# EAGLE design New Bench Power Supply 4 - eagle 5.1.0 (EAGLE 5.10)
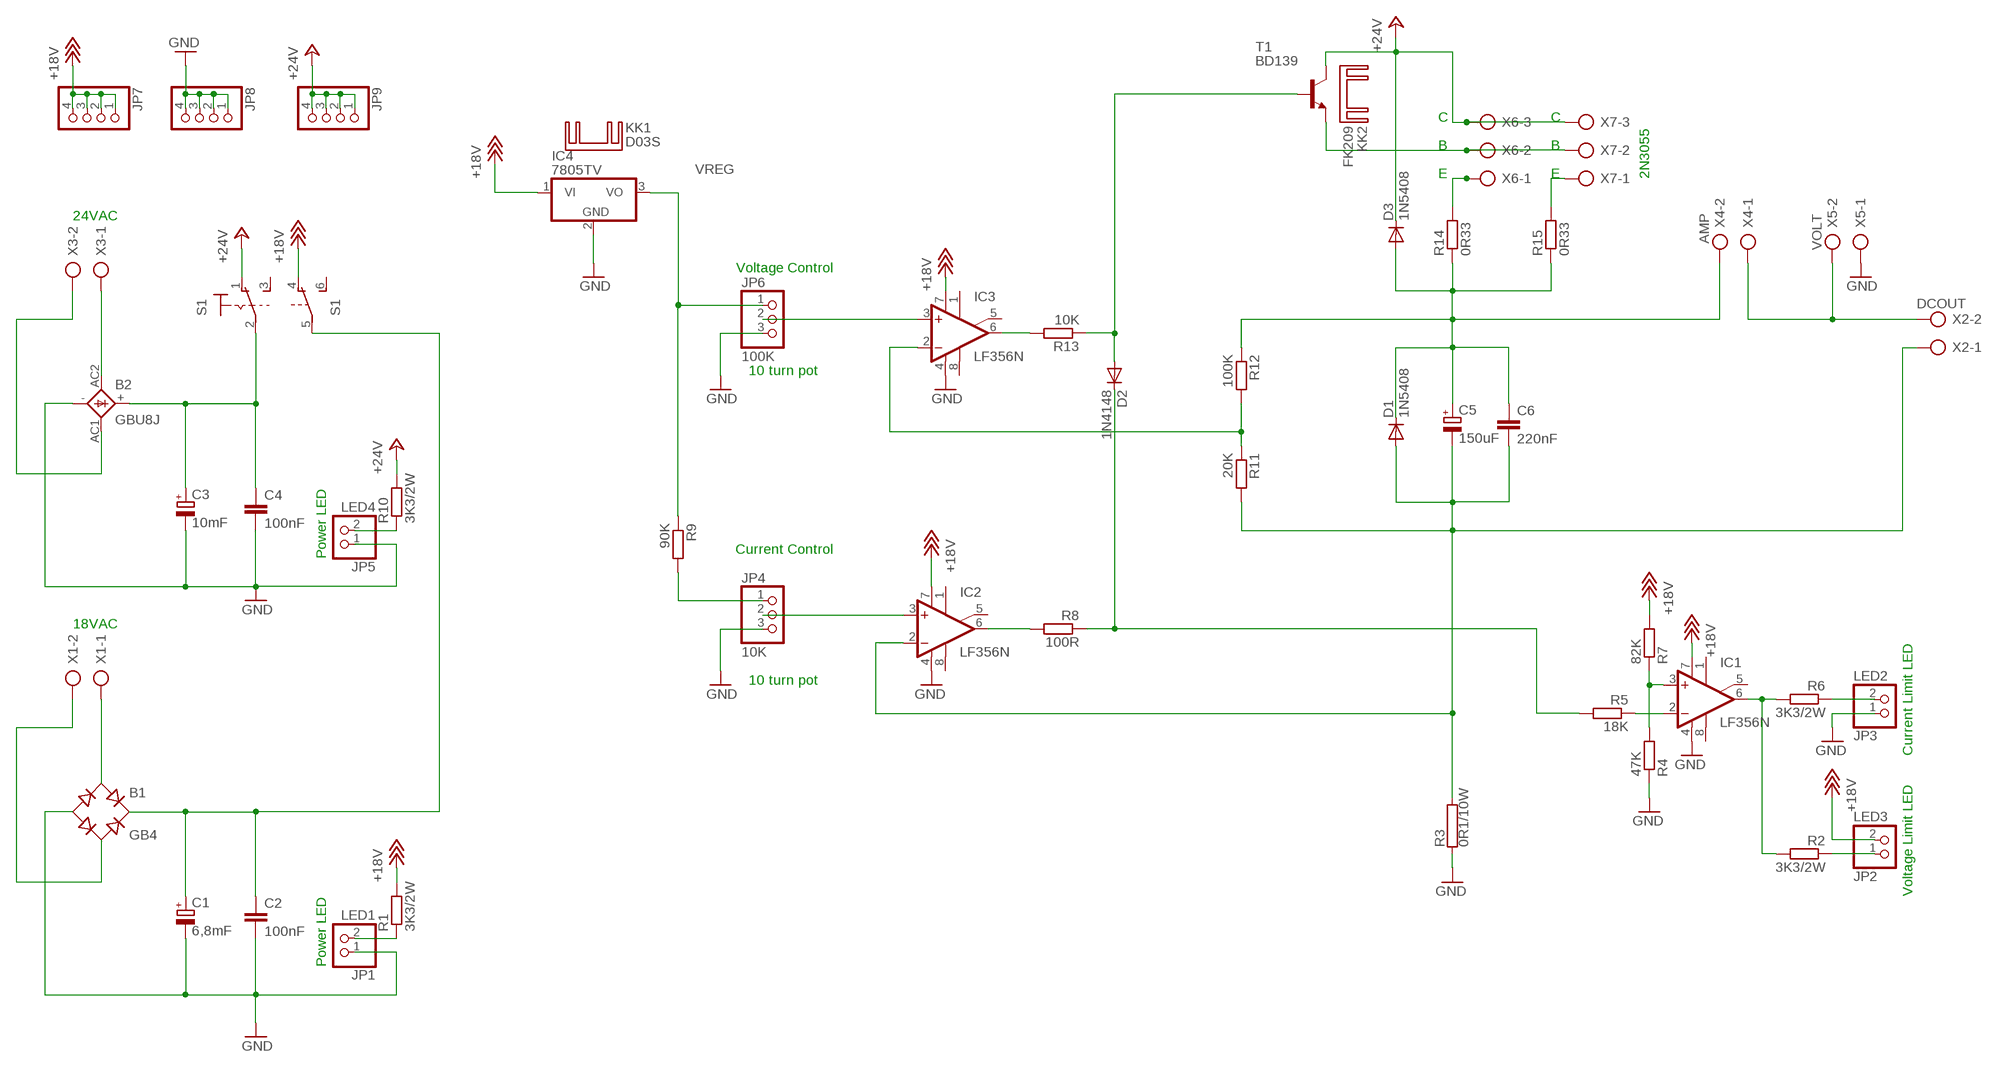
[diagram p0: schematic, sheet 1]

## Parts
B1  GB4  RB1A  [RB1A]
B2  GBU8J  GBU4  [GBU4S]
C1  6,8mF  CPOL-EUE10-30  [EB30D]
C2  100nF  C-EU075-032X103  [C075-032X103]
C3  10mF  CPOL-EUE10-30  [EB30D]
C4  100nF  C-EU075-032X103  [C075-032X103]
C5  150uF  CPOL-EUE7.5-18  [E7,5-18]
C6  220nF  C-EU102-043X133  [C102-043X133]
D1  1N5408  DIODE-DO201-15  [DO201-15]
D2  1N4148  DIODE-DO41-10  [DO41-10]
D3  1N5408  DIODE-DO201-15  [DO201-15]
IC1  LF356N  [DIL08]
IC2  LF356N  [DIL08]
IC3  LF356N  [DIL08]
IC4  7805TV  [TO220V]
JP1  LED1  PINHD-1X2  [1X02]
JP2  LED3  PINHD-1X2  [1X02]
JP3  LED2  PINHD-1X2  [1X02]
JP4  10K  PINHD-1X3  [1X03]
JP5  LED4  PINHD-1X2  [1X02]
JP6  100K  PINHD-1X3  [1X03]
JP7  PINHD-1X4  [1X04]
JP8  PINHD-1X4  [1X04]
JP9  PINHD-1X4  [1X04]
KK1  D03S  [D03S]
KK2  FK209  [FK209]
R1  3K3/2W  R-EU_0309/12  [0309/12]
R2  3K3/2W  R-EU_0309/12  [0309/12]
R3  0R1/10W  RRWM8X26  [RWM8X26]
R4  47K  R-EU_0207/10  [0207/10]
R5  18K  R-EU_0207/10  [0207/10]
R6  3K3/2W  R-EU_0309/12  [0309/12]
R7  82K  R-EU_0207/10  [0207/10]
R8  100R  R-EU_0207/10  [0207/10]
R9  90K  R-EU_0207/10  [0207/10]
R10  3K3/2W  R-EU_0309/12  [0309/12]
R11  20K  R-EU_0207/10  [0207/10]
R12  100K  R-EU_0207/10  [0207/10]
R13  10K  R-EU_0207/10  [0207/10]
R14  0R33  R-EU_0309/12  [0309/12]
R15  0R33  R-EU_0309/12  [0309/12]
S1  320-938  [320-938]
T1  BD139  -NPN-TO126V  [TO126V]
X1  AK300/2  [AK300/2]
X2  DCOUT  AK300/2  [AK300/2]
X3  AK300/2  [AK300/2]
X4  AMP  AK300/2  [AK300/2]
X5  VOLT  AK300/2  [AK300/2]
X6  AK300/3  [AK300/3]
X7  AK300/3  [AK300/3]

## Nets
+18V: IC1.7(V+) IC2.7(V+) IC3.7(V+) IC4.1(VI) JP2.2 JP7.1 JP7.2 JP7.3 JP7.4 R1.2 R7.2 S1.4(B:O)
+24V: D3.C JP9.1 JP9.2 JP9.3 JP9.4 R10.2 S1.1(1:O) T1.2(C) X6.3 X7.3
GND: B1.- B2.- C1.- C2.2 C3.- C4.2 IC1.4(V-) IC2.4(V-) IC3.4(V-) IC4.2(GND) JP1.1 JP3.1 JP4.3 JP5.1 JP6.3 JP8.1 JP8.2 JP8.3 JP8.4 R3.1 R4.1 X5.1
N$1: JP3.2 R6.1
N$2: IC1.6(OUT) R2.2 R6.2
N$3: IC1.2(-IN) R5.1
N$4: IC1.3(+IN) R4.2 R7.1
N$5: D2.C R5.2 R8.1
N$6: IC2.3(+IN) JP4.2
N$7: JP4.1 R9.2
N$8: IC2.6(OUT) R8.2
N$9: X2.2 X4.1 X5.2
N$10: C5.- C6.2 D1.A IC2.2(-IN) R3.2 R11.2 X2.1
N$12: JP2.1 R2.1
N$13: C5.+ C6.1 D1.C D3.A R12.1 R14.1 R15.1 X4.2
N$14: JP1.2 R1.1
N$15: B1.AC1 X1.1
N$16: IC3.3(+IN) JP6.2
N$18: IC3.6(OUT) R13.2
N$19: D2.A R13.1 T1.3(B)
N$20: R14.2 X6.1
N$21: T1.1(E) X6.2 X7.2
N$22: B2.AC2(AC1) X3.1
N$23: IC3.2(-IN) R11.1 R12.2
N$24: B2.AC1(AC2) X3.2
N$25: B1.AC2 X1.2
N$26: R15.2 X7.1
N$27: JP5.2 R10.1
N$33: B2.+ C3.+ C4.1 S1.2(1:P)
N$34: B1.+ C1.+ C2.1 S1.5(B:P)
VREG: IC4.3(VO) JP6.1 R9.1
Unconnected: IC1.1(ON1) IC1.5(ON2) IC1.8(OPT) IC2.1(ON1) IC2.5(ON2) IC2.8(OPT) IC3.1(ON1) IC3.5(ON2) IC3.8(OPT) S1.3(1:S) S1.6(B:S)

## Notes on the sheet
- C | C
- B | B
- E | E | 2N3055
- 24VAC
- Voltage Control
- 10 turn pot
- Current Control
- Power LED
- 18VAC
- 10 turn pot
- Current Limit LED
- Voltage Limit LED
- Power LED

## Library data of the parts
B1 = rectifier:RB1A: RECTIFIER 1 A
B2 = rectifier:GBU4: GENERAL INSTRUMENT RECTIFIER
C1 C3 C5 = resistor:CPOL-EU: POLARIZED CAPACITOR, European symbol
C2 C4 C6 = resistor:C-EU: CAPACITOR, European symbol
D1-D3 = diode:DIODE-: DIODE
IC1-IC3 = linear:LF356: OP AMP
IC4 = linear:78*: Positive VOLTAGE REGULATOR Source: http://cache.national.com/ds/LM/LM78L05.pdf http://www.fairchildsemi.com/ds/LM/LM7805.pdf
JP1-JP3 JP5 = pinhead:PINHD-1X2: PIN HEADER
JP4 JP6 = pinhead:PINHD-1X3: PIN HEADER
JP7-JP9 = pinhead:PINHD-1X4: PIN HEADER
KK1 = heatsink:D03S: HEATSINK distributor Schukat
KK2 = heatsink:FK209: HEATSINK manufacturer Fischer/distributor Buerklin
R1 R2 R4-R15 = resistor:R-EU_: RESISTOR, European symbol
R3 = resistor-power:R: Power Resitor
S1 = switch:320-938: TOGGLE SWITCH distributor RS Components
T1 = transistor:*-NPN-: NPN Transistror BF959 corrected 2008.03.06
X1-X5 = con-ptr500:AK300/2: CONNECTOR
X6 X7 = con-ptr500:AK300/3: CONNECTOR

## Net classes
0 default: width 0.508 mm, drill 0.762 mm, clearance 0.508 mm

## Board
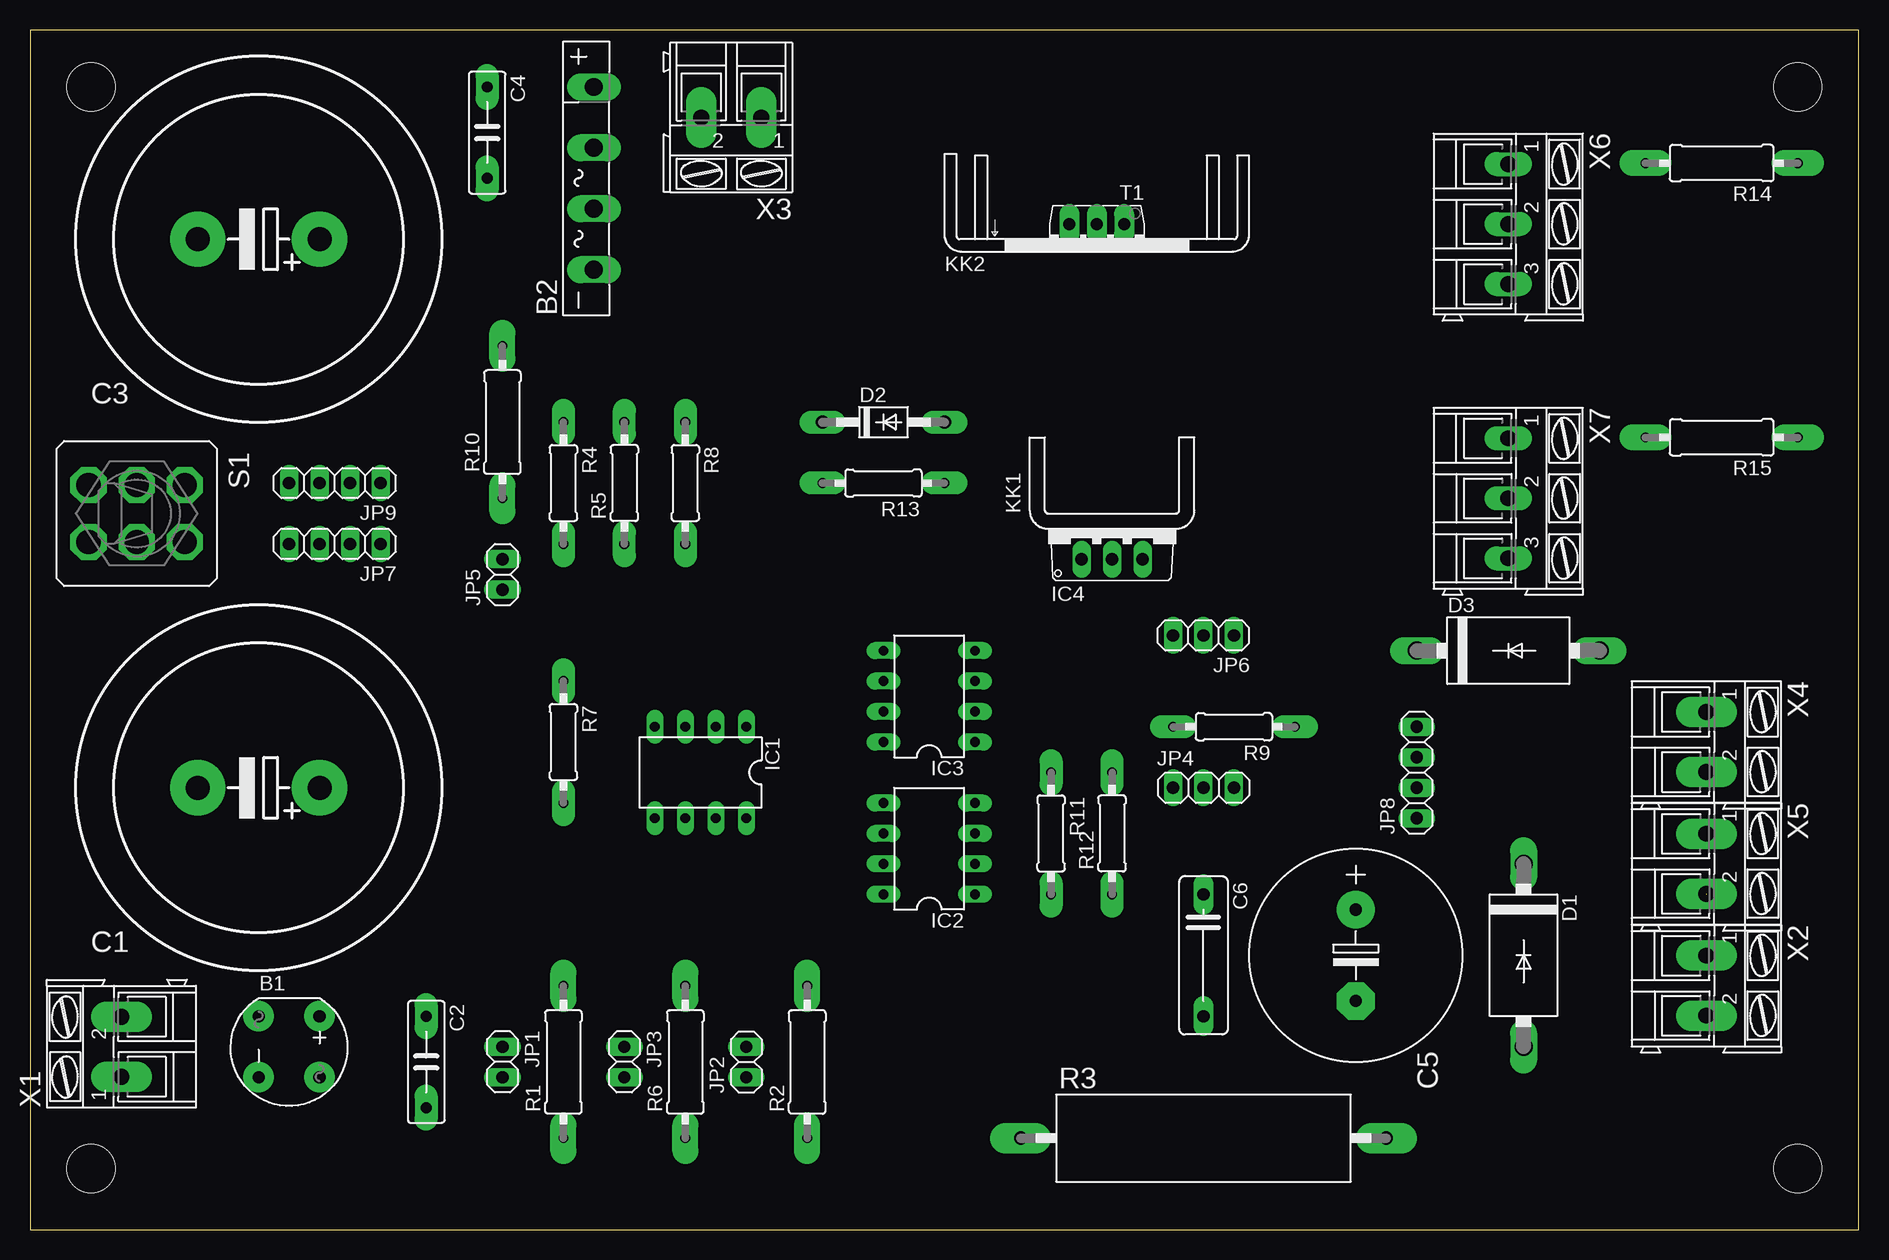
[diagram p1: board, top side]
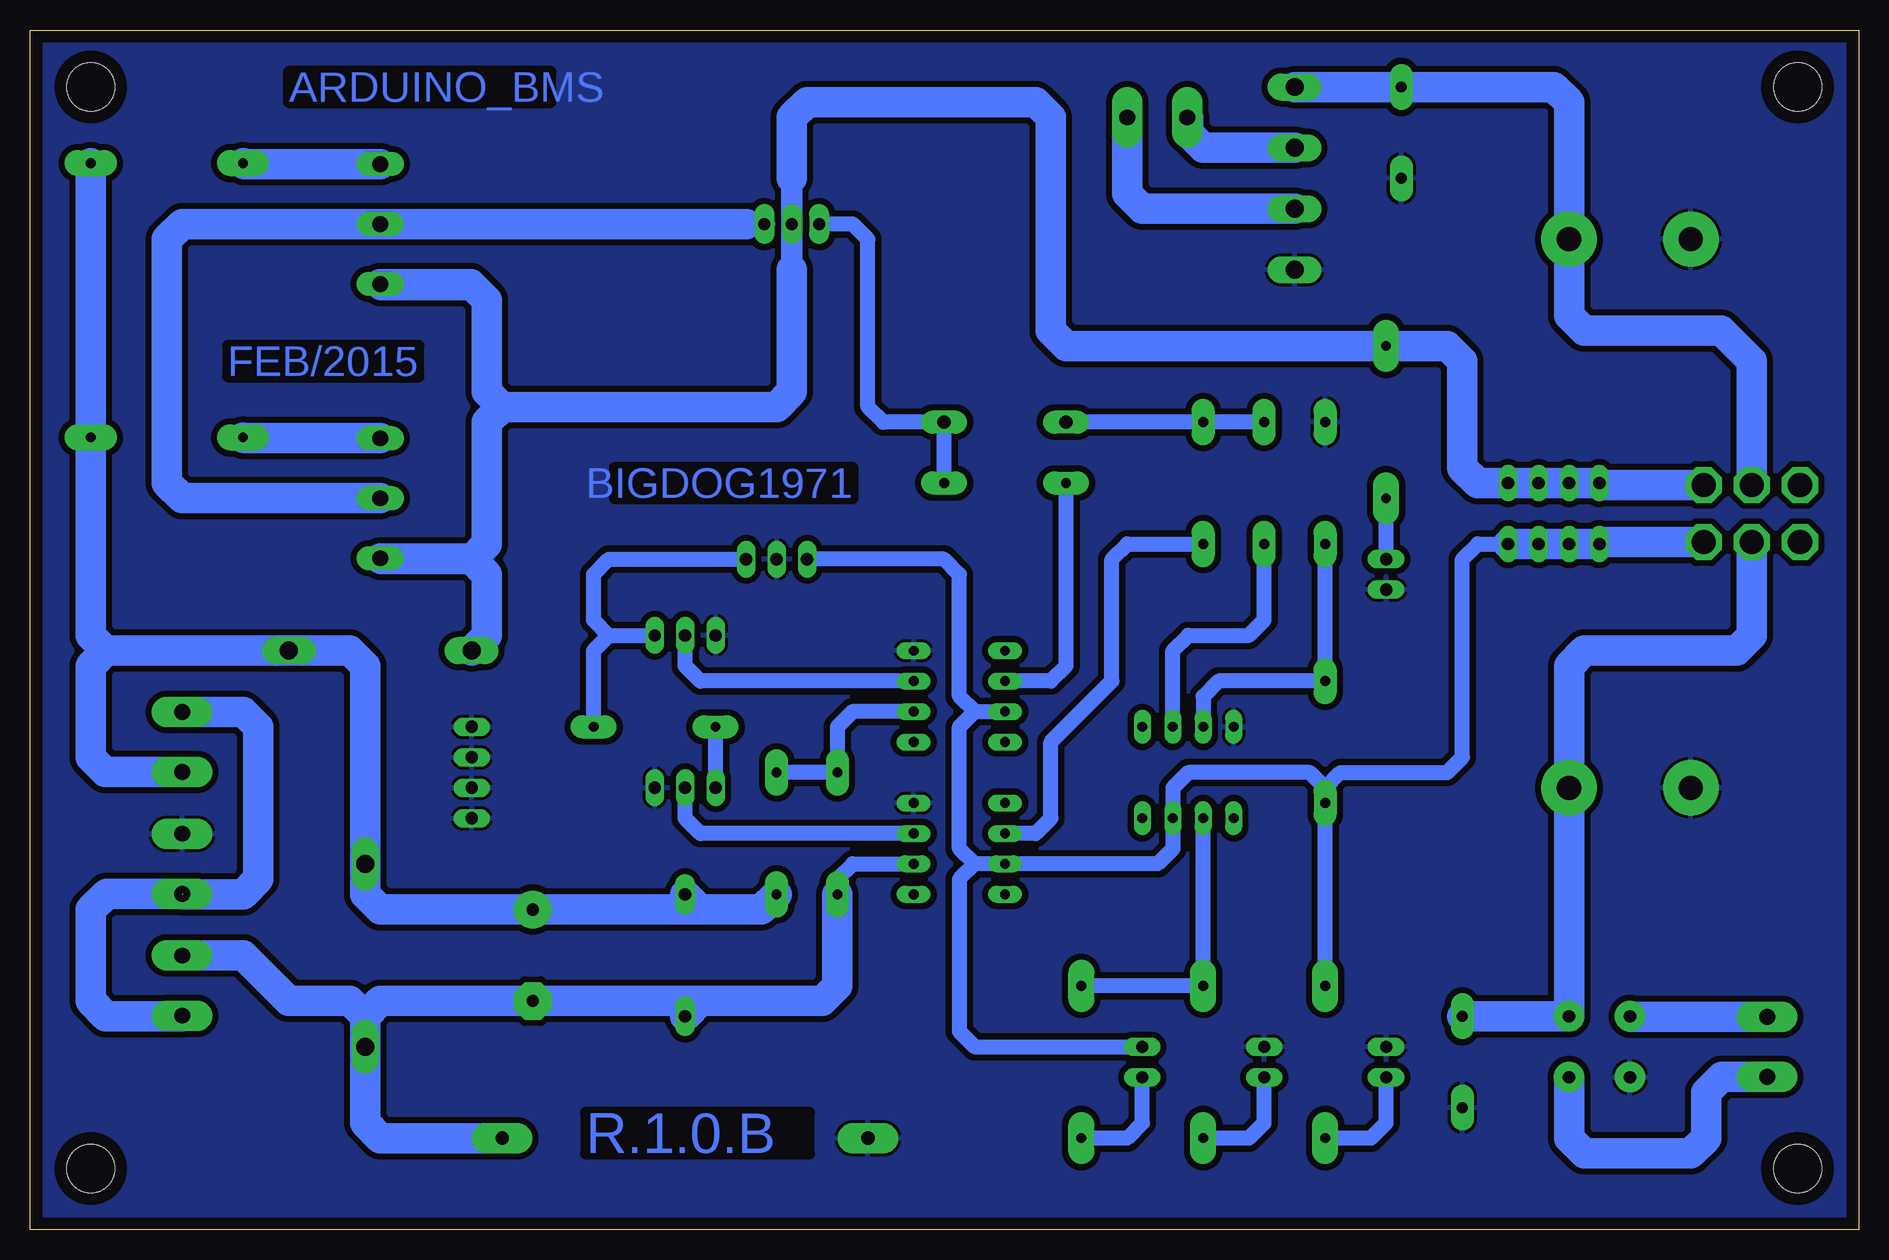
[diagram p2: board, bottom side, seen from below]

Size 152.38 x 100 mm. Coordinates in mm from the lower left corner, seen from the top.
Outline: 0,0 152.38,0 152.38,100 0,100 0,0
Copper layers (1*16): Top 0.035mm / dielectric 1.5mm / Bottom 0.035mm
Design rules "default": minimum track width 10mil, minimum drill 24mil, track to track 8mil, track to pad 8mil, pad to pad 8mil, via to via 8mil, smd to smd 8mil, copper to edge 40mil, drill to drill 8mil, minimum pad ring 10mil, minimum via ring 8mil, stop-mask expansion 4mil, vias tented up to drill 0mil, thermal gap 10mil
Holes 4 mm at 5.08,95.25 147.32,95.25 147.32,5.08 5.08,5.08

### Footprints (pad centres in the part's own frame; a part is rotated, then mirrored left to right if it is on the bottom)
RB1A = drill 1.016 pad 2.54 round: + -2.54,2.54; - 2.54,-2.54; AC1 2.54,2.54; AC2 -2.54,-2.54
GBU4S = drill 1.499 long: + 7.62,0; - -7.62,0; AC1 2.54,0; AC2 -2.54,0
EB30D = drill 2.007 pad 4.597 round: + -5.08,0; - 5.08,0
C075-032X103 = drill 0.914 pad 1.93 long: 1 -3.81,0; 2 3.81,0
E7,5-18 = drill 1.016 pad 3.15 round: + -3.81,0 | drill 1.016 pad 3.15 octagon: - 3.81,0
C102-043X133 = drill 1.016 pad 1.676 long: 1 -5.08,0; 2 5.08,0
DO201-15 = drill 1.499 long: A 7.62,0; C -7.62,0
DO41-10 = drill 1.118 pad 1.93 long: A 5.08,0; C -5.08,0
DIL08 = drill 0.813 pad 1.422 long: 1 -3.81,-3.81; 2 -1.27,-3.81; 3 1.27,-3.81; 4 3.81,-3.81; 5 3.81,3.81; 6 1.27,3.81; 7 -1.27,3.81; 8 -3.81,3.81
TO220V = drill 1.016 long: 1 -2.54,-2.54; 2 0,-2.54; 3 2.54,-2.54
1X02 = drill 1.016 long: 1 -1.27,0; 2 1.27,0
1X03 = drill 1.016 long: 1 -2.54,0; 2 0,0; 3 2.54,0
1X04 = drill 1.016 long: 1 -3.81,0; 2 -1.27,0; 3 1.27,0; 4 3.81,0
0309/12 = drill 0.813 pad 2.184 long: 1 -6.35,0; 2 6.35,0
RWM8X26 = drill 1.1 pad 2.54 long: 1 -15.24,0; 2 15.24,0
0207/10 = drill 0.813 pad 1.93 long: 1 -5.08,0; 2 5.08,0
320-938 = drill 2.007 octagon: 1 -2.388,4.013; 2 -2.388,0; 3 -2.388,-4.013; 4 2.388,4.013; 5 2.388,0; 6 2.388,-4.013
TO126V = drill 1.016 pad 1.676 long: 1 -2.286,-1.27; 2 0,-1.27; 3 2.286,-1.27
AK300/2 = drill 1.321 pad 2.54 long: 1 -2.515,0; 2 2.489,0
AK300/3 = drill 1.321 long: 1 -5.004,0; 2 0,0; 3 5.004,0

### Placement (x,y rotation side)
B1  21.59,15.24 270 top
B2  46.99,87.63 90 top
C1  19.05,36.83 180 top
C2  33.02,13.97 270 top
C3  19.05,82.55 180 top
C4  38.1,91.44 270 top
C5  110.49,22.86 270 top
C6  97.79,22.86 270 top
D1  124.46,22.86 270 top
D2  71.12,67.31 0 top
D3  123.19,48.26 0 top
IC1  55.88,38.1 180 top
IC2  74.93,31.75 90 top
IC3  74.93,44.45 90 top
IC4  90.17,58.42 0 top
JP1  39.37,13.97 270 top
JP2  59.69,13.97 90 top
JP3  49.53,13.97 270 top
JP4  97.79,36.83 0 top
JP5  39.37,54.61 90 top
JP6  97.79,49.53 180 top
JP7  25.4,57.15 180 top
JP8  115.57,38.1 90 top
JP9  25.4,62.23 180 top
KK1  90.17,59.69 0 top
KK2  88.9,82.55 0 top
R1  44.45,13.97 90 top
R2  64.77,13.97 90 top
R3  97.79,7.62 0 top
R4  44.45,62.23 270 top
R5  49.53,62.23 90 top
R6  54.61,13.97 90 top
R7  44.45,40.64 270 top
R8  54.61,62.23 270 top
R9  100.33,41.91 180 top
R10  39.37,67.31 90 top
R11  85.09,33.02 270 top
R12  90.17,33.02 90 top
R13  71.12,62.23 180 top
R14  140.97,88.9 180 top
R15  140.97,66.04 180 top
S1  8.89,59.69 270 top
T1  88.9,82.55 180 top
X1  7.62,15.24 90 top
X2  139.7,20.32 270 top
X3  58.42,92.71 180 top
X4  139.7,40.64 270 top
X5  139.7,30.48 270 top
X6  123.19,83.82 270 top
X7  123.19,60.96 270 top

### Tracks (layer width: path | path; a pad name or v marks a point on that pad's centre or on a via)
+18V
  Bottom 1.27: 73.66,43.18 IC3.7 | 73.66,43.18 74.93,41.91 74.93,31.75 73.66,30.48 | 73.66,30.48 IC2.7 58.42,30.48 57.15,31.75 IC1.7 57.15,36.83 55.88,38.1 45.72,38.1 44.45,36.83 | IC4.1 76.2,55.88 74.93,54.61 74.93,44.45 73.66,43.18 | JP2.2 73.66,15.24 74.93,16.51 74.93,29.21 73.66,30.48 | R1.2 R7.2 44.45,36.83 | JP7.1 31.75,57.15 33.02,55.88 33.02,39.37 34.29,38.1 43.18,38.1 44.45,36.83
  Bottom 2.54: S1.4 21.44,57.3 JP7.4 JP7.3 JP7.2 JP7.1
+24V
  Bottom 1.778: 88.9,80.01 T1.2 88.9,87.63
  Bottom 2.54: 113.03,68.58 114.3,67.31 114.3,57.15 115.49,55.96 X7.3 123.11,55.88 115.57,55.88 114.3,54.61 114.3,49.53 D3.C | 115.57,78.74 114.3,77.47 114.3,69.85 113.03,68.58 | 115.57,78.74 123.11,78.74 X6.3 115.65,78.82 115.57,78.74 | 113.03,68.58 90.17,68.58 88.9,69.85 88.9,80.01 | S1.1 21.44,62.08 JP9.4 JP9.3 JP9.2 JP9.1 31.75,62.23 33.02,63.5 33.02,72.39 34.29,73.66 R10.2 66.04,73.66 67.31,74.93 67.31,92.71 68.58,93.98 87.63,93.98 88.9,92.71 88.9,87.63
GND
  pour Bottom: -1.27,101.6 153.67,100.33 153.67,-2.54 -1.27,-1.27
N$1
  Bottom 1.27: JP3.2 49.53,8.89 50.8,7.62 R6.1
N$2
  Bottom 1.27: R2.2 R6.2 IC1.6
N$3
  Bottom 1.27: IC1.2 57.15,48.26 55.88,49.53 50.8,49.53 49.53,50.8 R5.1
N$4
  Bottom 1.27: IC1.3 54.61,44.45 53.34,45.72 R7.1 R4.2
N$5
  Bottom 1.27: D2.C R8.1 R5.2
N$6
  Bottom 1.27: IC2.3 96.52,33.02 97.79,34.29 JP4.2
N$7
  Bottom 1.27: JP4.1 R9.2
N$8
  Bottom 1.27: R8.2 60.96,57.15 62.23,55.88 62.23,45.72 67.31,40.64 67.31,34.29 68.58,33.02 IC2.6
N$9  (1 unrouted)
  Bottom 2.54: X5.2 146,27.99 147.32,26.67 147.32,19.05 146.05,17.78 139.75,17.78 X2.2 | X4.1 134.59,43.16 133.35,41.91 133.35,29.21 134.62,27.94 139.7,27.94
N$10
  Bottom 1.27: IC2.2 83.82,30.48 85.09,29.21 R11.2
  Bottom 2.54: R3.2 123.19,7.62 124.46,8.89 D1.A 124.46,17.78 | 124.46,17.78 123.19,19.05 C5.- 96.52,19.05 | 124.46,17.78 125.73,19.05 130.81,19.05 134.62,22.86 139.68,22.86 X2.1 | 96.52,19.05 86.36,19.05 85.09,20.32 R11.2 | 96.52,19.05 C6.2
N$12
  Bottom 1.27: JP2.1 59.69,8.89 60.96,7.62 R2.1
N$13
  Bottom 2.54: R14.1 R15.1 147.32,49.53 146.05,48.26 | 96.52,26.67 C5.+ 123.19,26.67 124.46,27.94 D1.C 124.46,46.99 125.73,48.26 D3.A 146.05,48.26 | R12.1 91.44,26.67 96.52,26.67 | 96.52,26.67 C6.1 | X4.2 146.1,38.15 147.32,39.37 147.32,46.99 146.05,48.26
N$14
  Bottom 1.27: JP1.2 39.37,8.89 40.64,7.62 R1.1
N$15
  Bottom 2.54: X1.1 11.4,12.72 12.7,11.43 12.7,7.62 13.97,6.35 22.86,6.35 24.13,7.62 B1.AC1
N$16
  Bottom 1.27: IC3.3 96.52,45.72 97.79,46.99 JP6.2
N$18
  Bottom 1.27: IC3.6 67.31,45.72 66.04,46.99 R13.2
N$19
  Bottom 1.27: R13.1 D2.A 81.28,67.31 82.55,68.58 82.55,82.55 83.82,83.82 T1.3
N$20
  Bottom 2.54: X6.1 134.54,88.82 R14.2
N$21
  Bottom 1.778: T1.1 92.71,83.82
  Bottom 2.54: X7.2 139.7,60.96 140.97,62.23 140.97,82.55 139.7,83.82 X6.2 92.71,83.82
N$22
  Bottom 2.54: B2.AC2 59.69,85.09 60.96,86.36 60.96,92.69 X3.1
N$23
  Bottom 1.27: IC3.2 83.82,43.18 85.09,41.91 R11.1 R12.2
N$24
  Bottom 2.54: B2.AC1 54.61,90.17 55.88,91.44 55.88,92.66 X3.2
N$25
  Bottom 2.54: X1.2 19,17.73 B1.AC2
N$26
  Bottom 2.54: X7.1 134.54,65.96 R15.2
N$27
  Bottom 1.27: JP5.2 R10.1
N$33
  Bottom 2.54: S1.2 8.89,72.39 11.43,74.93 22.86,74.93 24.13,76.2 C3.+ 24.13,93.98 25.4,95.25 C4.1 B2.+
N$34
  Bottom 2.54: C2.1 B1.+ C1.+ 24.13,46.99 22.86,48.26 10.16,48.26 8.89,49.53 S1.5
VREG
  Bottom 1.27: IC4.3 104.14,55.88 105.41,54.61 105.41,50.8 104.14,49.53 | 104.14,49.53 JP6.1 | 104.14,49.53 105.41,48.26 R9.1

### Text on the board
Bottom: ARDUINO_BMS | FEB/2015 | BIGDOG1971 | R.1.0.B